# EasyEDA Pro project ProProject_运放实验_2024-09-24.epro, schematic Schematic1
Create Date: 2023-09-07; Page Name: P1; Project Name: 运放实验; Schematic Name: Schematic1; Update Date: 2023-09-07; Company: 嘉立创EDA; Page Size: A4; Version: V1.0
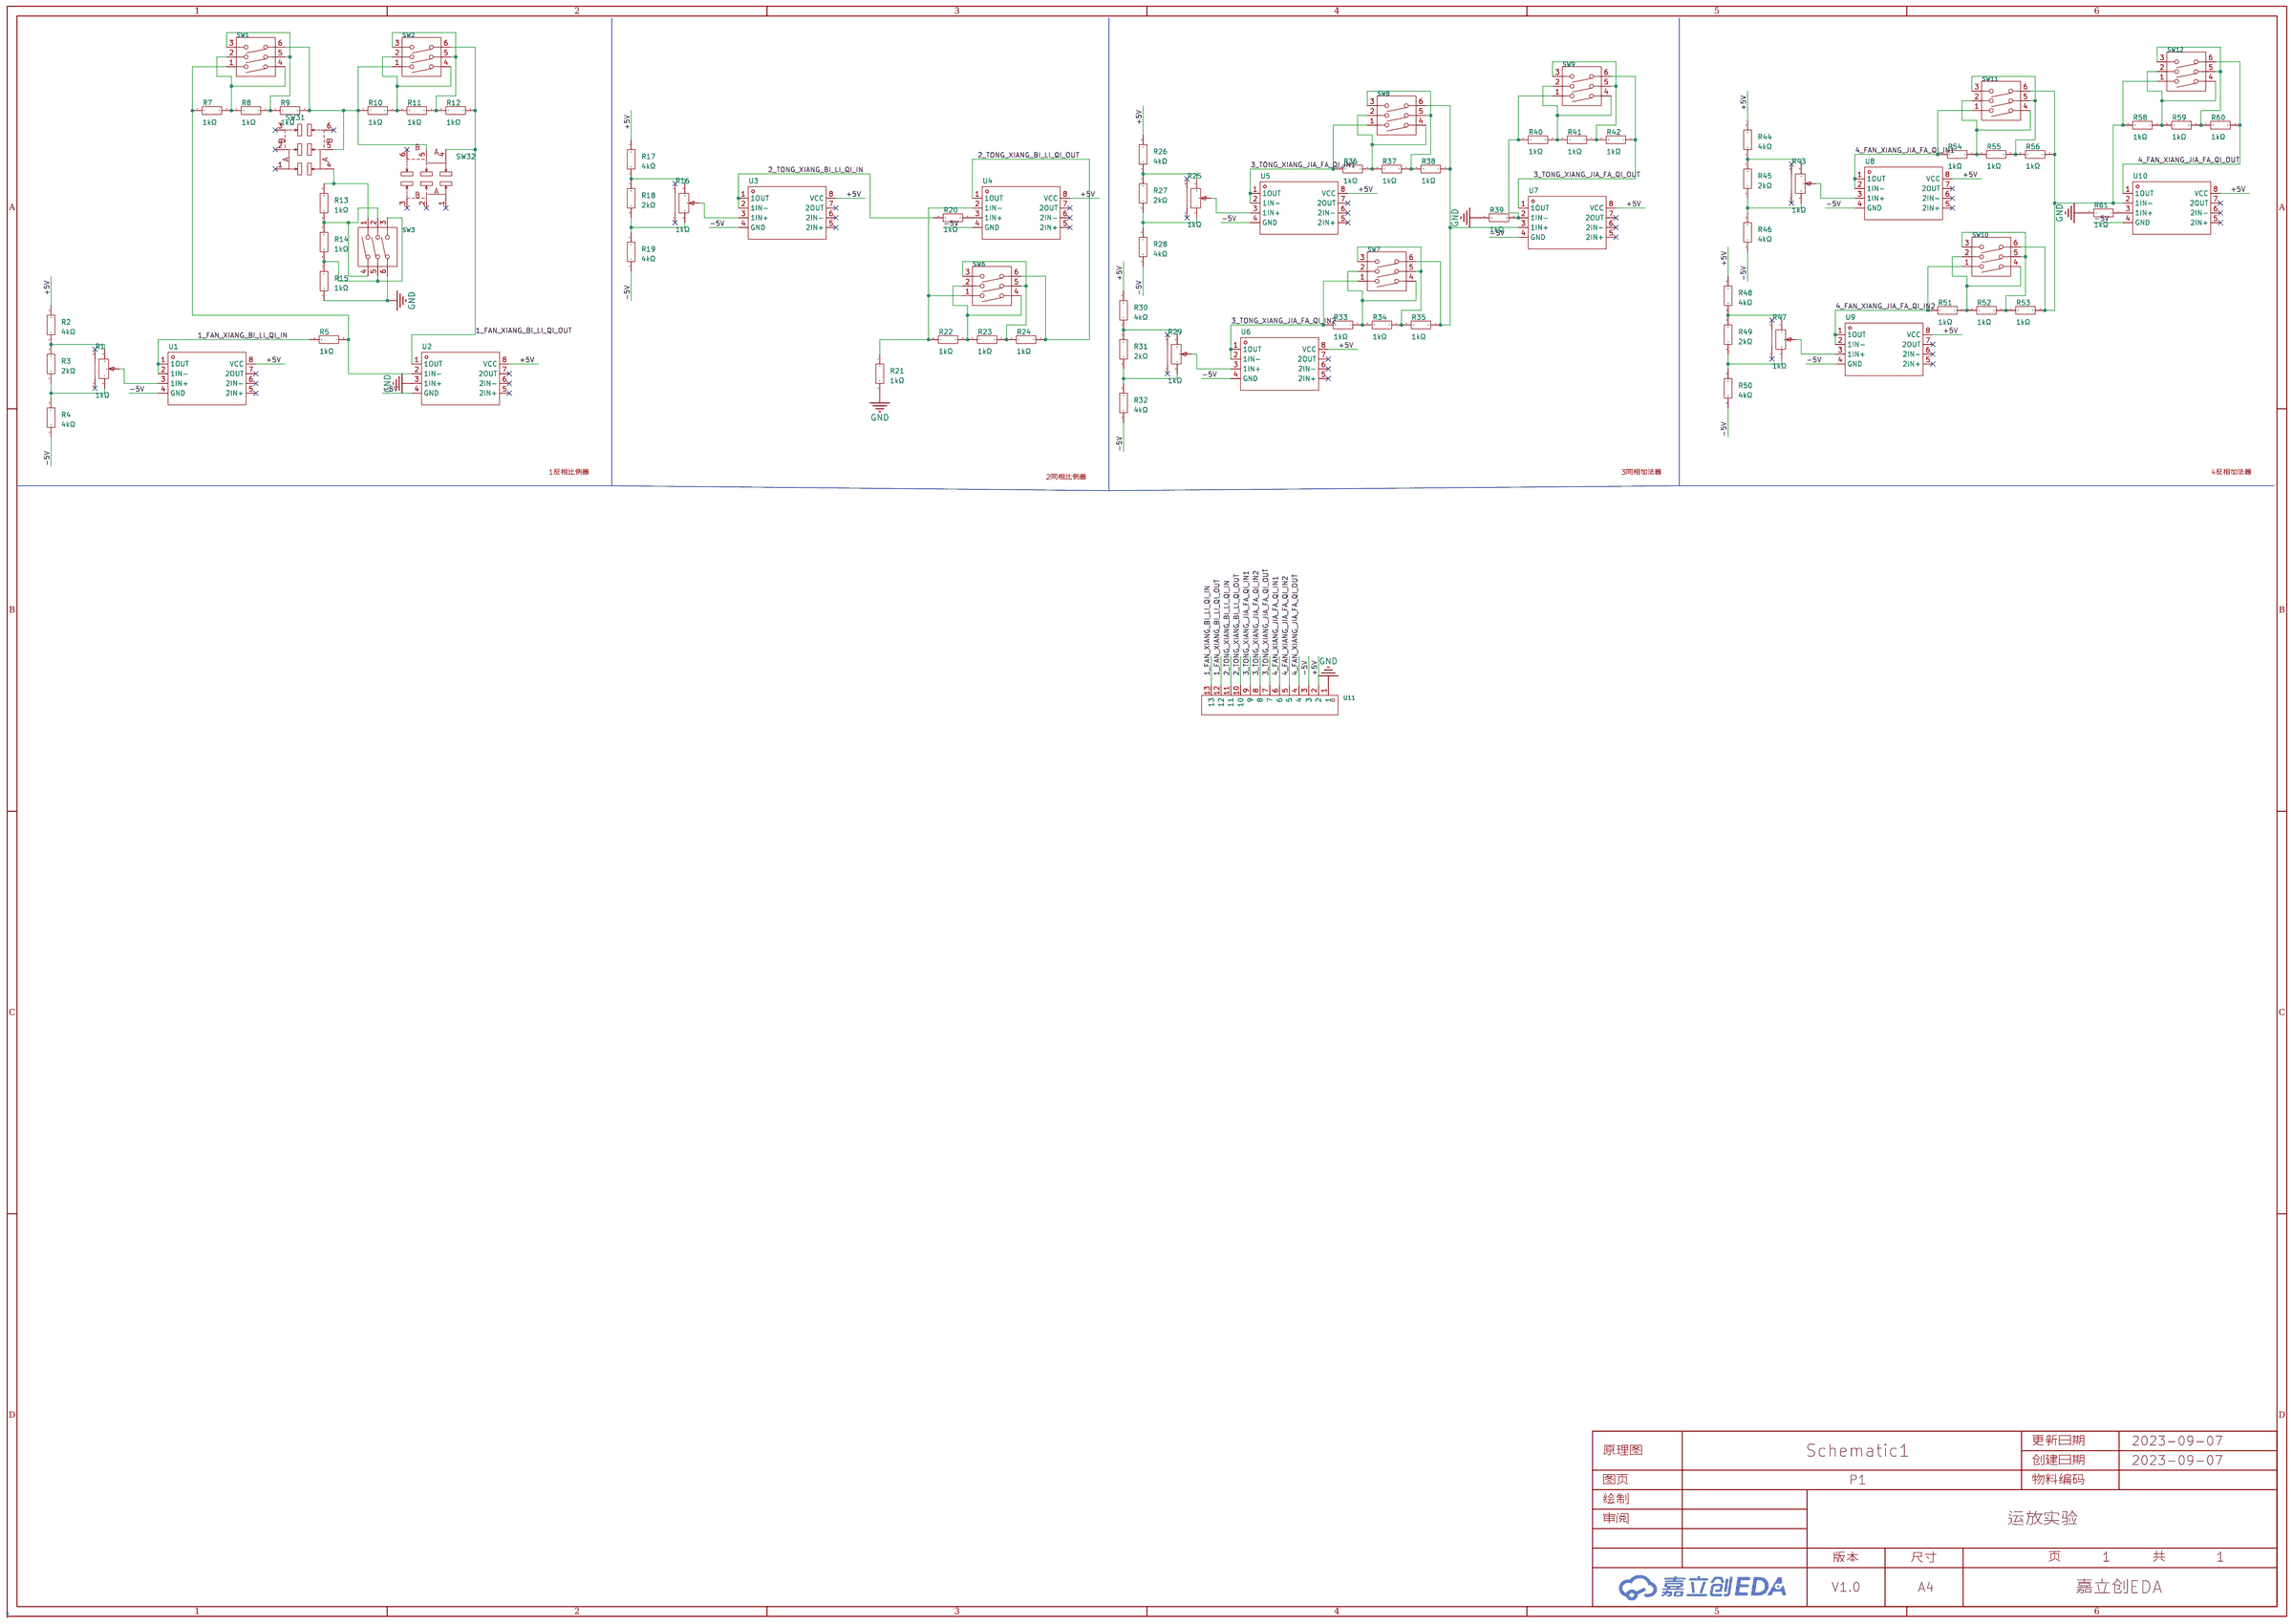
[diagram p3: schematic sheet]

## Parts
R1  1kΩ  [RES-ADJ-TH_RK09K1130AJ3]
R2  4kΩ  [R0603]
R3  2kΩ  [R0603]
R4  4kΩ  [R0603]
R5  1kΩ  [R0603]
R7  1kΩ  [R0603]
R8  1kΩ  [R0603]
R9  1kΩ  [R0603]
R10  1kΩ  [R0603]
R11  1kΩ  [R0603]
R12  1kΩ  [R0603]
R13  1kΩ  [R0603]
R14  1kΩ  [R0603]
R15  1kΩ  [R0603]
R16  1kΩ  [RES-ADJ-TH_RK09K1130AJ3]
R17  4kΩ  [R0603]
R18  2kΩ  [R0603]
R19  4kΩ  [R0603]
R20  1kΩ  [R0603]
R21  1kΩ  [R0603]
R22  1kΩ  [R0603]
R23  1kΩ  [R0603]
R24  1kΩ  [R0603]
R25  1kΩ  [RES-ADJ-TH_RK09K1130AJ3]
R26  4kΩ  [R0603]
R27  2kΩ  [R0603]
R28  4kΩ  [R0603]
R29  1kΩ  [RES-ADJ-TH_RK09K1130AJ3]
R30  4kΩ  [R0603]
R31  2kΩ  [R0603]
R32  4kΩ  [R0603]
R33  1kΩ  [R0603]
R34  1kΩ  [R0603]
R35  1kΩ  [R0603]
R36  1kΩ  [R0603]
R37  1kΩ  [R0603]
R38  1kΩ  [R0603]
R39  1kΩ  [R0603]
R40  1kΩ  [R0603]
R41  1kΩ  [R0603]
R42  1kΩ  [R0603]
R43  1kΩ  [RES-ADJ-TH_RK09K1130AJ3]
R44  4kΩ  [R0603]
R45  2kΩ  [R0603]
R46  4kΩ  [R0603]
R47  1kΩ  [RES-ADJ-TH_RK09K1130AJ3]
R48  4kΩ  [R0603]
R49  2kΩ  [R0603]
R50  4kΩ  [R0603]
R51  1kΩ  [R0603]
R52  1kΩ  [R0603]
R53  1kΩ  [R0603]
R54  1kΩ  [R0603]
R55  1kΩ  [R0603]
R56  1kΩ  [R0603]
R58  1kΩ  [R0603]
R59  1kΩ  [R0603]
R60  1kΩ  [R0603]
R61  1kΩ  [R0603]
SW1  DSWB03LHGET  [SW-TH_DSWB03LHGET]
SW2  DSWB03LHGET  [SW-TH_DSWB03LHGET]
SW3  DSWB03LHGET  [SW-TH_DSWB03LHGET]
SW6  DSWB03LHGET  [SW-TH_DSWB03LHGET]
SW7  DSWB03LHGET  [SW-TH_DSWB03LHGET]
SW8  DSWB03LHGET  [SW-TH_DSWB03LHGET]
SW9  DSWB03LHGET  [SW-TH_DSWB03LHGET]
SW10  DSWB03LHGET  [SW-TH_DSWB03LHGET]
SW11  DSWB03LHGET  [SW-TH_DSWB03LHGET]
SW12  DSWB03LHGET  [SW-TH_DSWB03LHGET]
SW31  MST22D18G2  [SW-SMD_MST22D18G2]
SW32  MST22D18G2  [SW-SMD_MST22D18G2]
U1  LM393DR  [SOIC-8_L5.0-W4.0-P1.27-LS6.0-BL]
U2  LM393DR  [SOIC-8_L5.0-W4.0-P1.27-LS6.0-BL]
U3  LM393DR  [SOIC-8_L5.0-W4.0-P1.27-LS6.0-BL]
U4  LM393DR  [SOIC-8_L5.0-W4.0-P1.27-LS6.0-BL]
U5  LM393DR  [SOIC-8_L5.0-W4.0-P1.27-LS6.0-BL]
U6  LM393DR  [SOIC-8_L5.0-W4.0-P1.27-LS6.0-BL]
U7  LM393DR  [SOIC-8_L5.0-W4.0-P1.27-LS6.0-BL]
U8  LM393DR  [SOIC-8_L5.0-W4.0-P1.27-LS6.0-BL]
U9  LM393DR  [SOIC-8_L5.0-W4.0-P1.27-LS6.0-BL]
U10  LM393DR  [SOIC-8_L5.0-W4.0-P1.27-LS6.0-BL]
U11  PM254-1-13-Z-8.5  [HDR-TH_13P-P2.54-V-F]

## Library data of the parts
R1 R16 R25 R29 R43 R47 = RK09K1130AJ3: 阻值:10kΩ;精度:±20%;功率:50mW;; LCSC Part Name: 10kΩ ±20%; Supplier Part: C388854; Manufacturer: ALPSALPINE(阿尔卑斯阿尔派); Supplier Footprint: 插件; JLCPCB Part Class: 扩展库; Datasheet: https://atta.szlcsc.com/upload/public/pdf/source/20190429/C388854_7CB4260EB45E5FBD5A81223BC5101220.pdf; Supplier: LCSC; Tolerance: ±20%; Power(Watts): 50mW; Rated Voltage: 20V
R2-R5 R7-R15 R17-R24 R26-R28 R30-R42 R44-R46 R48-R56 R58-R61 = 0603WAF1002T5E: 电阻类型:厚膜电阻;阻值:10kΩ;精度:±1%;功率:100mW;; LCSC Part Name: 厚膜电阻 10kΩ ±1% 100mW; Supplier Part: C25804; Manufacturer: UNI-ROYAL(厚声); Supplier Footprint: 0603; JLCPCB Part Class: 基础库; Datasheet: https://atta.szlcsc.com/upload/public/pdf/source/20200306/C422600_1E6D84923E4A46A82E41ADD87F860B5C.pdf; Supplier: LCSC; Type: 厚膜电阻; Tolerance: ±1%; Power(Watts): 100mW; Temperature Coefficient: ±100ppm/℃; Overload Voltage (Max): 75V; Operating Temperature Range: -55℃~+155℃
SW1-SW3 SW6-SW12 = DSWB03LHGET: 类型:平拨,凸起式;电路结构:单刀单掷;开关位数:3;使用寿命:-;颜色:红色;; LCSC Part Name: 间距1.27mm 平拨,凸起式 3位拨码开关; Supplier Part: C99420; Manufacturer: YE; Supplier Footprint: 插件; JLCPCB Part Class: 扩展库; Datasheet: https://atta.szlcsc.com/upload/public/pdf/source/20170330/1490854274194.pdf; Supplier: LCSC; Type: 平拨,凸起式; Circuit: 单刀单掷; Number of Positions: 3; Lead Pitch: 2.54mm; Color: 红色
SW31 SW32 = MST22D18G2: 额定电流(DC)：50mA 额定电压(DC)：12V 电路结构：单刀双掷 安装方式：立贴 机械寿命：10000 滑钮形状：矩形柱状 引脚样式：SMD接片 工作温度：-30℃~+80℃ 开关长度：9.1mm 开关宽度：3.6mm 开关高度：3.45mm 柄高：2mm; LCSC Part Name: 两档立式贴片 6脚拨动 柄长2.0MM; Supplier Part: C431544; Manufacturer: SHOU HAN(首韩); Supplier Footprint: SMD,3.6x9.1mm; JLCPCB Part Class: 扩展库; Datasheet: https://atta.szlcsc.com/upload/public/pdf/source/20190925/C431544_D32DFFD935A96A6C5145903882D4ABA1.pdf; Supplier: LCSC
U1-U10 = LM393DR: 比较器组数:2;电源电压:2V~36V,±1V~18V;各通道供电电流:2.5mA;输出类型:CMOS, MOS, Open-Collector, TTL;传播延迟:-;; Supplier Part: C67470; Manufacturer: TI(德州仪器); Supplier Footprint: SOIC-8-150mil; JLCPCB Part Class: 扩展库; Datasheet: https://atta.szlcsc.com/upload/public/pdf/source/20160127/1457707757853.pdf; Supplier: LCSC; Number of Elements: 2; Supply Voltage（Single）: 2V~36V,±1V~18V; Iq per channel (Typ): 2.5mA; Output Type: CMOS, MOS, Open-Collector, TTL; Operating Temperature: 0°C ~ 70°C
U11 = PM254-1-13-Z-8.5: 排数:单排;总孔位数:13P;间距:2.54mm;插孔结构:1x13P;行距:-;安装类型:直插;圆孔/方孔:方孔;额定电流:3A;额定电压:-;插孔方向:顶部;塑高:8.5mm;工作温度范围:-40℃~+105℃;; LCSC Part Name: 2.54mm 1x13P; Supplier Part: C2897376; Manufacturer: HCTL(华灿天禄); Supplier Footprint: 插件,P=2.54mm; JLCPCB Part Class: 扩展库; Datasheet: https://atta.szlcsc.com/upload/public/pdf/source/20230609/534BE42964C679BDE98E061007C4ABD6.pdf; Supplier: LCSC; Number of Rows: 单排; Number of Holes: 13P; Pitch: 2.54mm; Holes Structure: 1x13P; Mounting Type: 直插; Circular Hole / Square Hole: 方孔; Current Rating (Max): 3A; Holes Direction: 顶部; Insulation Height: 8.5mm; Operating Temperature Range: -40℃~+105℃

## Nets
+5V: R2.2 R17.2 R26.2 R30.2 R44.2 R48.2 U1.8(VCC) U2.8(VCC) U3.8(VCC) U4.8(VCC) U5.8(VCC) U6.8(VCC) U7.8(VCC) U8.8(VCC) U9.8(VCC) U10.8(VCC) U11.2
-5V: R4.1 R19.1 R28.1 R32.1 R46.1 R50.1 U1.4(GND) U2.4(GND) U3.4(GND) U4.4(GND) U5.4(GND) U6.4(GND) U7.4(GND) U8.4(GND) U9.4(GND) U10.4(GND) U11.3
GND: R15.1 R21.2 R39.2 R61.2 SW3.6 U2.3(1IN+) U11.1
1_FAN_XIANG_BI_LI_QI_IN: R5.2 U1.1(1OUT) U1.2(1IN-) U11.13
1_FAN_XIANG_BI_LI_QI_OUT: R12.1 SW2.6 SW32.4 U2.1(1OUT) U11.12
2_TONG_XIANG_BI_LI_QI_IN: R20.2 U3.1(1OUT) U3.2(1IN-) U11.11
2_TONG_XIANG_BI_LI_QI_OUT: R24.1 SW6.6 U4.1(1OUT) U11.10
3_TONG_XIANG_JIA_FA_QI_IN1: R36.2 SW8.1 U5.1(1OUT) U5.2(1IN-) U11.9
3_TONG_XIANG_JIA_FA_QI_IN2: R33.2 SW7.1 U6.1(1OUT) U6.2(1IN-) U11.8
3_TONG_XIANG_JIA_FA_QI_OUT: R42.1 SW9.6 U7.1(1OUT) U11.7
4_FAN_XIANG_JIA_FA_QI_IN1: R54.2 SW11.1 U8.1(1OUT) U8.2(1IN-) U11.6
4_FAN_XIANG_JIA_FA_QI_IN2: R51.2 SW10.1 U9.1(1OUT) U9.2(1IN-) U11.5
4_FAN_XIANG_JIA_FA_QI_OUT: R60.1 SW12.6 U10.1(1OUT) U11.4
$1N2081: R20.1 U4.3(1IN+)
Net-(R1-1): R1.1 R3.1 R4.2
Net-(R1-2): R1.2 U1.3(1IN+)
Net-(R1-3): R1.3 R2.1 R3.2
Net-(R5-1): R5.1 R7.2 SW1.1 U2.2(1IN-)
Net-(R7-1): R7.1 R8.2 SW1.2 SW1.4
Net-(R8-1): R8.1 R9.2 SW1.3 SW1.5
Net-(R9-1): R9.1 R10.2 SW1.6 SW2.1 SW31.5 SW32.5
Net-(R10-1): R10.1 R11.2 SW2.2 SW2.4
Net-(R11-1): R11.1 R12.2 SW2.3 SW2.5
Net-(R13-1): R13.1 R14.2 SW3.2 SW3.4
Net-(R13-2): R13.2 SW3.1 SW31.4
Net-(R14-1): R14.1 R15.2 SW3.3 SW3.5
Net-(R16-1): R16.1 R18.1 R19.2
Net-(R16-2): R16.2 U3.3(1IN+)
Net-(R16-3): R16.3 R17.1 R18.2
Net-(R21-1): R21.1 R22.2 SW6.1 U4.2(1IN-)
Net-(R22-1): R22.1 R23.2 SW6.2 SW6.4
Net-(R23-1): R23.1 R24.2 SW6.3 SW6.5
Net-(R25-1): R25.1 R27.1 R28.2
Net-(R25-2): R25.2 U5.3(1IN+)
Net-(R25-3): R25.3 R26.1 R27.2
Net-(R29-1): R29.1 R31.1 R32.2
Net-(R29-2): R29.2 U6.3(1IN+)
Net-(R29-3): R29.3 R30.1 R31.2
Net-(R33-1): R33.1 R34.2 SW7.2 SW7.4
Net-(R34-1): R34.1 R35.2 SW7.3 SW7.5
Net-(R35-1): R35.1 R38.1 SW7.6 SW8.6 U7.3(1IN+)
Net-(R36-1): R36.1 R37.2 SW8.2 SW8.4
Net-(R37-1): R37.1 R38.2 SW8.3 SW8.5
Net-(R39-1): R39.1 R40.2 SW9.1 U7.2(1IN-)
Net-(R40-1): R40.1 R41.2 SW9.2 SW9.4
Net-(R41-1): R41.1 R42.2 SW9.3 SW9.5
Net-(R43-1): R43.1 R45.1 R46.2
Net-(R43-2): R43.2 U8.3(1IN+)
Net-(R43-3): R43.3 R44.1 R45.2
Net-(R47-1): R47.1 R49.1 R50.2
Net-(R47-2): R47.2 U9.3(1IN+)
Net-(R47-3): R47.3 R48.1 R49.2
Net-(R51-1): R51.1 R52.2 SW10.2 SW10.4
Net-(R52-1): R52.1 R53.2 SW10.3 SW10.5
Net-(R53-1): R53.1 R56.1 R58.2 SW10.6 SW11.6 SW12.1 U10.2(1IN-)
Net-(R54-1): R54.1 R55.2 SW11.2 SW11.4
Net-(R55-1): R55.1 R56.2 SW11.3 SW11.5
Net-(R58-1): R58.1 R59.2 SW12.2 SW12.4
Net-(R59-1): R59.1 R60.2 SW12.3 SW12.5
Net-(R61-1): R61.1 U10.3(1IN+)

Not connected (* = marked no-connect by the designer): R1 4* 5*; R16 4* 5*; R25 4* 5*; R29 4* 5*; R43 4* 5*; R47 4* 5*; SW31 1* 2* 3* 6*; SW32 1* 2* 3* 6*; U1 5(2IN+)* 6(2IN-)* 7(2OUT)*; U2 5(2IN+)* 6(2IN-)* 7(2OUT)*; U3 5(2IN+)* 6(2IN-)* 7(2OUT)*; U4 5(2IN+)* 6(2IN-)* 7(2OUT)*; U5 5(2IN+)* 6(2IN-)* 7(2OUT)*; U6 5(2IN+)* 6(2IN-)* 7(2OUT)*; U7 5(2IN+)* 6(2IN-)* 7(2OUT)*; U8 5(2IN+)* 6(2IN-)* 7(2OUT)*; U9 5(2IN+)* 6(2IN-)* 7(2OUT)*; U10 5(2IN+)* 6(2IN-)* 7(2OUT)*

## Notes on the sheet
- 1反相比例器
- 2同相比例器
- 3同相加法器
- 4反相加法器
